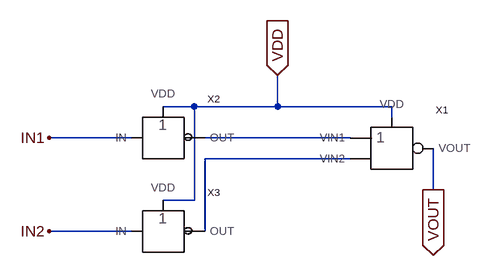
[diagram p0: schematic AND_ON_NOR.asc]
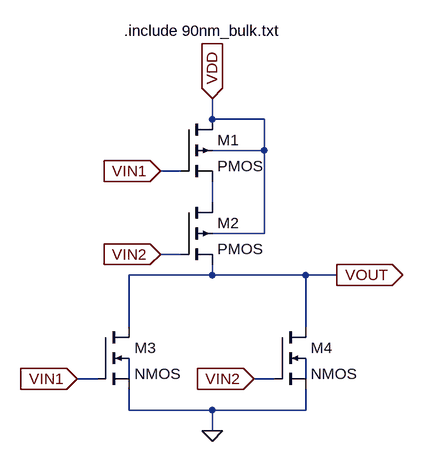
[diagram p1: sub-circuit nor.asc]
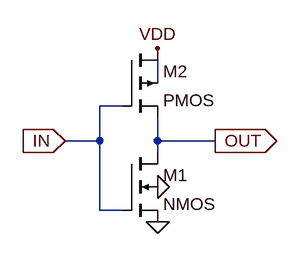
[diagram p2: sub-circuit invertor.asc]
AND_ON_NOR.asc, the LTspice schematic file:
Version 4
SHEET 1 880 680
WIRE -112 96 -160 96
WIRE 16 96 16 48
WIRE 16 96 -112 96
WIRE 192 96 16 96
WIRE 192 112 192 96
WIRE -208 144 -336 144
WIRE 128 144 -96 144
WIRE 128 176 -96 176
WIRE 256 224 256 160
WIRE -112 240 -112 96
WIRE -112 240 -160 240
WIRE -208 288 -336 288
WIRE -96 288 -96 176
FLAG -336 144 IN1
FLAG -336 288 IN2
FLAG 16 48 VDD
IOPIN 16 48 In
FLAG 256 224 VOUT
IOPIN 256 224 Out
SYMBOL NOR 192 160 R0
SYMATTR InstName X1
SYMBOL INVERTOR -160 144 R0
SYMATTR InstName X2
SYMBOL INVERTOR -160 288 R0
SYMATTR InstName X3

nor.asc, the sub-circuit schematic file:
Version 4
SHEET 1 880 680
WIRE 208 96 208 64
WIRE 288 96 208 96
WIRE 288 144 288 96
WIRE 288 144 208 144
WIRE 160 176 128 176
WIRE 208 224 208 192
WIRE 288 272 288 144
WIRE 288 272 208 272
WIRE 160 304 128 304
WIRE 208 336 208 320
WIRE 208 336 80 336
WIRE 352 336 208 336
WIRE 400 336 352 336
WIRE 80 416 80 336
WIRE 352 416 352 336
WIRE 32 496 0 496
WIRE 80 496 80 464
WIRE 304 496 272 496
WIRE 352 496 352 464
WIRE 80 544 80 512
WIRE 208 544 80 544
WIRE 352 544 352 512
WIRE 352 544 208 544
WIRE 208 576 208 544
FLAG 128 176 VIN1
IOPIN 128 176 In
FLAG 0 496 VIN1
IOPIN 0 496 In
FLAG 128 304 VIN2
IOPIN 128 304 In
FLAG 272 496 VIN2
IOPIN 272 496 In
FLAG 208 64 VDD
IOPIN 208 64 In
FLAG 400 336 VOUT
IOPIN 400 336 Out
FLAG 208 576 0
SYMBOL pmos4 160 96 R0
SYMATTR InstName M1
SYMATTR Value2 l=90n w=400n
SYMBOL pmos4 160 224 R0
SYMATTR InstName M2
SYMATTR Value2 l=90n w=400n
SYMBOL nmos4 32 416 R0
SYMATTR InstName M3
SYMATTR Value2 l=90n w=200n
SYMBOL nmos4 304 416 R0
SYMATTR InstName M4
SYMATTR Value2 l=90n w=200n
TEXT 72 -40 Left 2 !.include 90nm_bulk.txt

invertor.asc, the sub-circuit schematic file:
Version 4
SHEET 1 880 680
WIRE 240 80 240 48
WIRE 192 112 160 112
WIRE 160 160 160 112
WIRE 160 160 112 160
WIRE 240 160 240 128
WIRE 320 160 240 160
WIRE 240 176 240 160
WIRE 160 256 160 160
WIRE 192 256 160 256
FLAG 112 160 IN
IOPIN 112 160 In
FLAG 320 160 OUT
IOPIN 320 160 Out
FLAG 240 272 0
FLAG 240 224 0
FLAG 240 32 VDD
SYMBOL nmos4 192 176 R0
SYMATTR InstName M1
SYMATTR Value2 l=90n w=200n
SYMBOL pmos4 192 32 R0
SYMATTR InstName M2
SYMATTR Value2 l=90n w=400n

The netlist it stands for:
* AND_ON_NOR.asc
XX1 N001 VOUT N002 VDD nor
XX2 IN1 N001 VDD invertor
XX3 IN2 N002 VDD invertor

* block symbol definitions
.subckt nor VIN1 VOUT VIN2 VDD
M1 VDD VIN1 N001 VDD PMOS l=90n w=400n
M2 N001 VIN2 VOUT VDD PMOS l=90n w=400n
M3 VOUT VIN1 0 N002 NMOS l=90n w=200n
M4 VOUT VIN2 0 N003 NMOS l=90n w=200n
.include 90nm_bulk.txt
.ends nor

.subckt invertor IN OUT VDD
M1 OUT IN 0 0 NMOS l=90n w=200n
M2 VDD IN OUT N001 PMOS l=90n w=400n
.ends invertor

.model NMOS NMOS
.model PMOS PMOS
.lib standard.mos
.backanno
.end